# Altium schematic sheet Power_Supply.SchDoc
size A
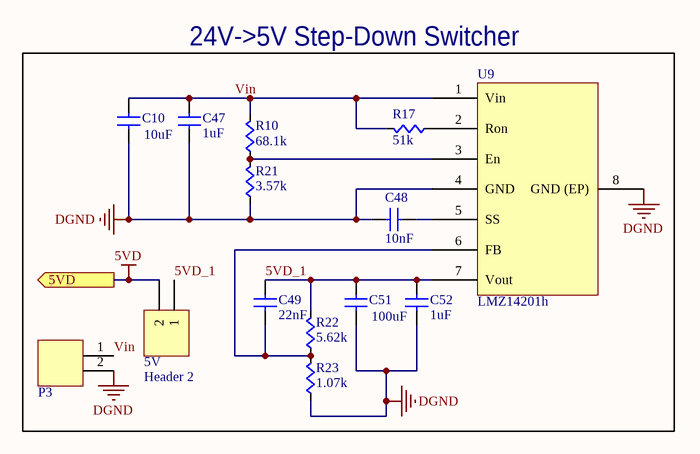
[diagram p0: Power_Supply.SchDoc]

## Parts
5V  Header 2  [HDR1X2]
C10  value 10uF  [CAP1210]  (hidden comment: CAP1210)
C47  value 1uF  [CAP1206]  (hidden comment: Cap1206)
C48  value 10nF  [CAPC0603]  (hidden comment: Cap)
C49  value 22nF  [CAPC0603]  (hidden comment: Cap)
C51  value 100uF  [CAP1210]  (hidden comment: CAP1210)
C52  value 1uF  [CAP1206]  (hidden comment: Cap1206)
P3  2-pin Horz Sherlock  [MOLEX-HDR-1X2-SHERLOCK-HORZ]  (value not drawn)
R10  value 68.1k  [RES0603]  (hidden comment: Res)
R17  value 51k  [RES0603]  (hidden comment: Res)
R21  value 3.57k  [RES0603]  (hidden comment: Res)
R22  value 5.62k  [RES0603]  (hidden comment: Res)
R23  value 1.07k  [RES0603]  (hidden comment: Res)
U9  LMZ14201h  [TO-PMOD-7]

## Blocks framed on the sheet
24V->5V Step-Down Switcher: 5V C10 C47-C49 C51 C52 P3 R10 R17 R21-R23 U9

## Ports
5VD (out)

## Nets
5VD: 5V.2 ; port 5VD
DGND: C10.2(B) C47.2(B) C48.1(A) C51.2(B) C52.2(B) P3.2 R21.2(B) R23.2(B) U9.4(GND) U9.8(GND_(EP))
5VD_1: 5V.1 C49.2(B) C51.1(A) C52.1(A) R22.1(A) U9.7(Vout)
Vin: C10.1(A) C47.1(A) P3.1 R10.1(A) R17.1(A) U9.1(Vin)
NetC48_2: C48.2(B) U9.5(SS)
NetC49_1: C49.1(A) R22.2(B) R23.1(A) U9.6(FB)
NetR10_2: R10.2(B) R21.1(A) U9.3(En)
NetR17_2: R17.2(B) U9.2(Ron)

## Library data of the parts
5V = Header 2: Header, 2-Pin; LatestRevisionDate: 17-Jul-2002; LatestRevisionNote: Re-released for DXP Platform.; Publisher: Altium Limited
C10 C51 = CAP1210: CAP CER 10UF 50V 20% X5R 1210; Supplier 1: Digi-Key
  C10: Supplier Part Number 1: 587-2225-1-ND
  C51: Supplier Part Number 1: 587-1387-1-ND
C47 C52 = Cap1206: CAP CER 1UF 50V 10% X7R 1206; Supplier 1: Digi-Key; Supplier Part Number 1: 587-2230-1-ND
P3 = MOLEX-HDR-1x2-SHERLOCK_RA: Header, Molex, 2mm Pitch Sherlock Header, Single Row, Horizontal, 2 Circuits, Length 3.3mm,  0353630260; Manufacturer: Molex Inc; Manufacturer Part Number: 0353630260; Supplier Part Number 1: WM18931-ND; Supplier 1: Digi-Key
U9 = LMZ14201h: IC BUCK SYNC ADJ 1A TO-PMOD-7; Supplier 1: Digi-Key; Supplier Part Number 1: LMZ14201HTZX/NOPBCT-ND
C48 C49 = Cap: Supplier 1: Digi-Key; Supplier Part Number 1: 1276-1000-1-ND
R10 R17 R21-R23 = Res: Supplier 1: Digi-Key; Supplier Part Number 1: RMCF0603JT10K0CT-ND